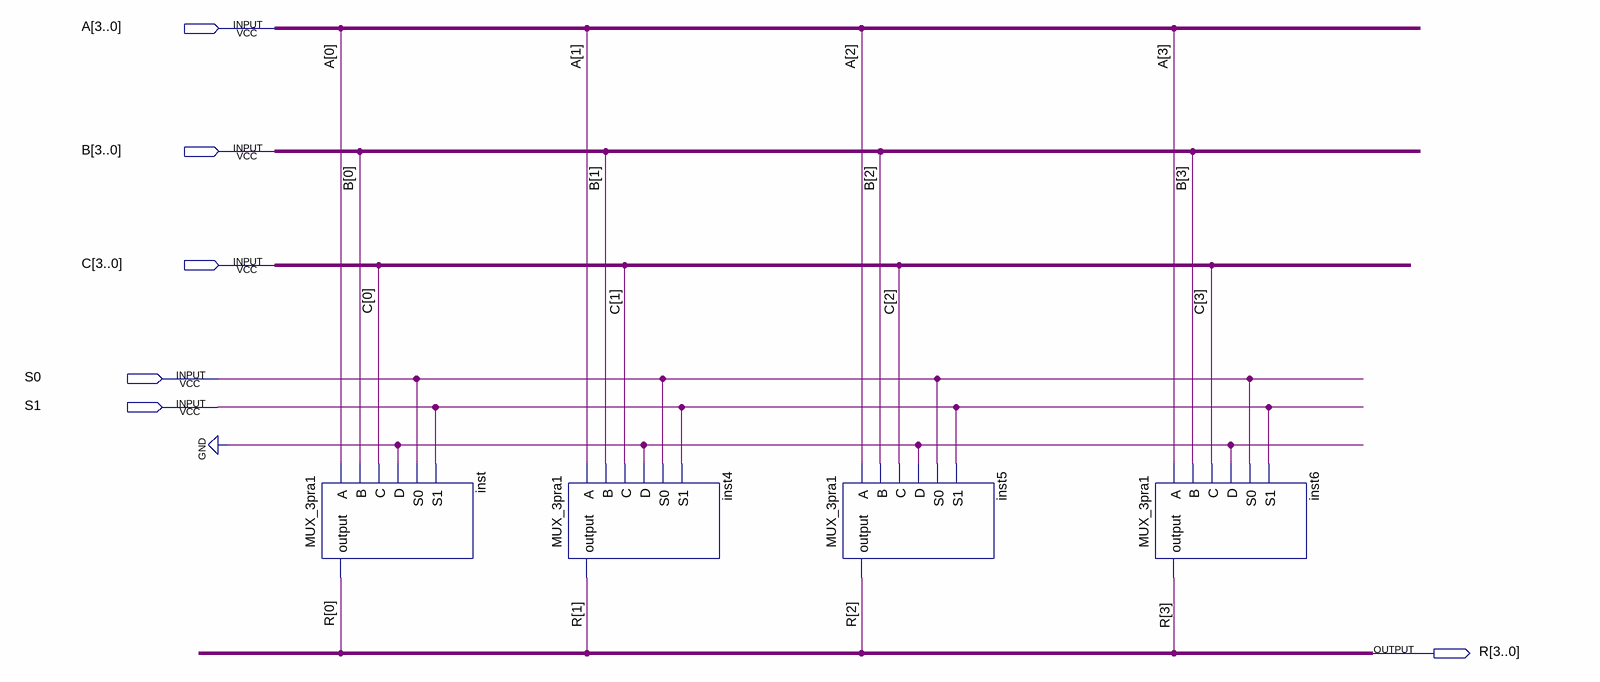
[diagram p0: schematic sheet]
// Quartus schematic Vector_MUX.bdf as structural Verilog: 4 symbols, 6 pins
module Vector_MUX (
  input  [3:0] A,
  input  [3:0] B,
  input  [3:0] C,
  input  S0,
  input  S1,
  output [3:0] R
);

  MUX_3pra1 inst (.A(A[0]), .B(B[0]), .C(C[0]), .D(1'b0), .S0(S0), .S1(S1), .\output (R[0]));
  MUX_3pra1 inst4 (.A(A[1]), .B(B[1]), .C(C[1]), .D(1'b0), .S0(S0), .S1(S1), .\output (R[1]));
  MUX_3pra1 inst5 (.A(A[2]), .B(B[2]), .C(C[2]), .D(1'b0), .S0(S0), .S1(S1), .\output (R[2]));
  MUX_3pra1 inst6 (.A(A[3]), .B(B[3]), .C(C[3]), .D(1'b0), .S0(S0), .S1(S1), .\output (R[3]));
endmodule
